# Altium schematic sheet Placa adaptadora TMS320F28335.SchDoc: Placa adaptadora TMS320F28335
size A4; Author: Anderson, Jorge; CompanyName: LEICI - FI-UNLP; Revision: 1.3; SheetNumber: 1; SheetTotal: 5; PageSetup: Record=PageOptions|CenterHorizontal=True|CenterVertical=True|PrintScale=1.00|XCorrection=1.00|YCorrection=1.00|PrintKind=2|BorderSize=5000000|LeftOffset=0|BottomOffset=0|Orientation=2|PaperLength=1000|PaperWidth=1000|Scale=100|PaperSource=7|PrintQuality=-3|MediaType=1|DitherType=10|PrintScaleMode=0|PaperKind=A4|PaperIndex=9; ProjectName: Placa adaptadora TMS320F28335
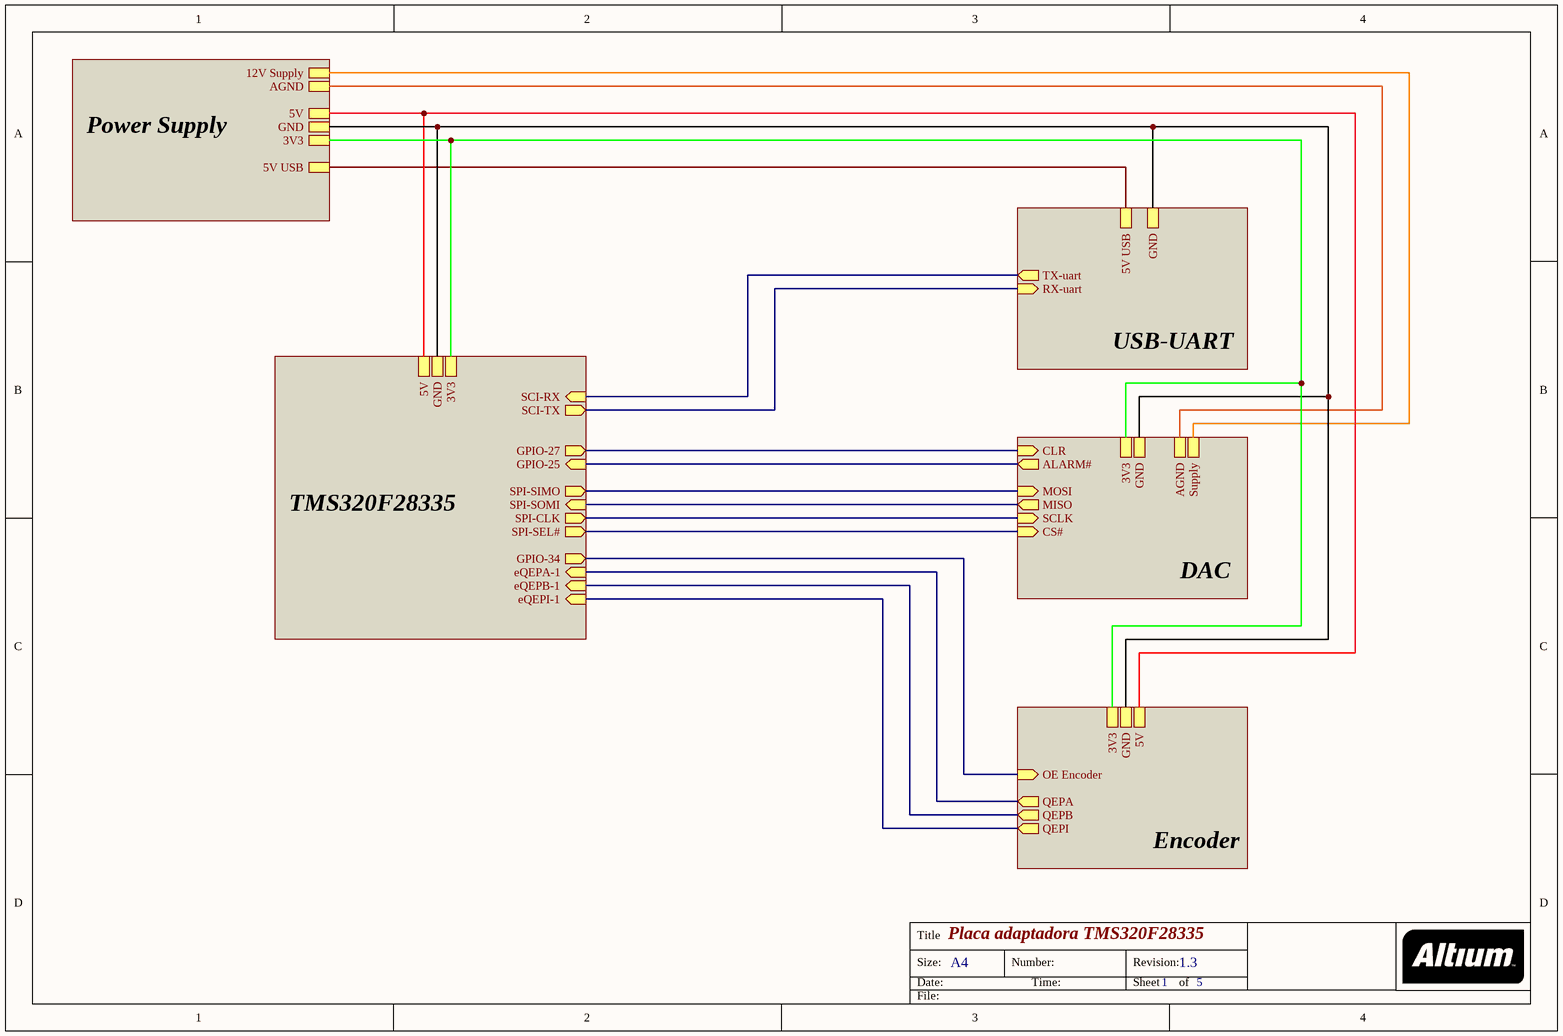
[diagram p0: Placa adaptadora TMS320F28335.SchDoc]

## Sub-sheets
DAC = DAC.SchDoc: CS# (in), SCLK (in), MOSI (in), MISO (out), 3V3, GND, CLR (in), ALARM# (out), Supply, AGND
Encoder = Encoder.SchDoc: QEPA (out), QEPB (out), QEPI (out), 3V3, 5V, GND, OE Encoder (in)
Power Supply = SupplyPower.SchDoc: 5V USB, 5V, 12V Supply, AGND, GND, 3V3
TMS320F28335 = TMS320F28335.SchDoc: 5V, GND, SCI-TX (out), SCI-RX (in), eQEPA-1 (in), eQEPB-1 (in), eQEPI-1 (in), SPI-SIMO (out), SPI-SOMI (in), SPI-CLK (out), SPI-SEL# (out), GPIO-27 (out), GPIO-34 (out), 3V3, GPIO-25 (in)
USB-UART = USB-uart.SchDoc: 5V USB, TX-uart (out), RX-uart (in), GND

## Nets
(unnamed): sheet TMS320F28335/5V, sheet Encoder/5V, sheet Power Supply/5V
(unnamed): sheet TMS320F28335/GND, sheet DAC/GND, sheet USB-UART/GND, sheet Encoder/GND, sheet Power Supply/GND
(unnamed): sheet TMS320F28335/SCI-TX, sheet USB-UART/RX-uart
(unnamed): sheet TMS320F28335/SCI-RX, sheet USB-UART/TX-uart
(unnamed): sheet TMS320F28335/eQEPA-1, sheet Encoder/QEPA
(unnamed): sheet TMS320F28335/eQEPB-1, sheet Encoder/QEPB
(unnamed): sheet TMS320F28335/eQEPI-1, sheet Encoder/QEPI
(unnamed): sheet TMS320F28335/SPI-SIMO, sheet DAC/MOSI
(unnamed): sheet TMS320F28335/SPI-SOMI, sheet DAC/MISO
(unnamed): sheet TMS320F28335/SPI-CLK, sheet DAC/SCLK
(unnamed): sheet TMS320F28335/SPI-SEL#, sheet DAC/CS#
(unnamed): sheet TMS320F28335/GPIO-27, sheet DAC/CLR
(unnamed): sheet TMS320F28335/GPIO-34, sheet Encoder/OE Encoder
(unnamed): sheet TMS320F28335/3V3, sheet DAC/3V3, sheet Encoder/3V3, sheet Power Supply/3V3
(unnamed): sheet TMS320F28335/GPIO-25, sheet DAC/ALARM#
(unnamed): sheet DAC/Supply, sheet Power Supply/12V Supply
(unnamed): sheet DAC/AGND, sheet Power Supply/AGND
(unnamed): sheet USB-UART/5V USB, sheet Power Supply/5V USB

## Notes on the sheet
- Title
- Size:
- Date:
- A4
- Number:
- Time:
- Revision:
- Sheet
- of
- File: